# EasyEDA Pro project ProPrj_主车电路板.epro, board PCB3
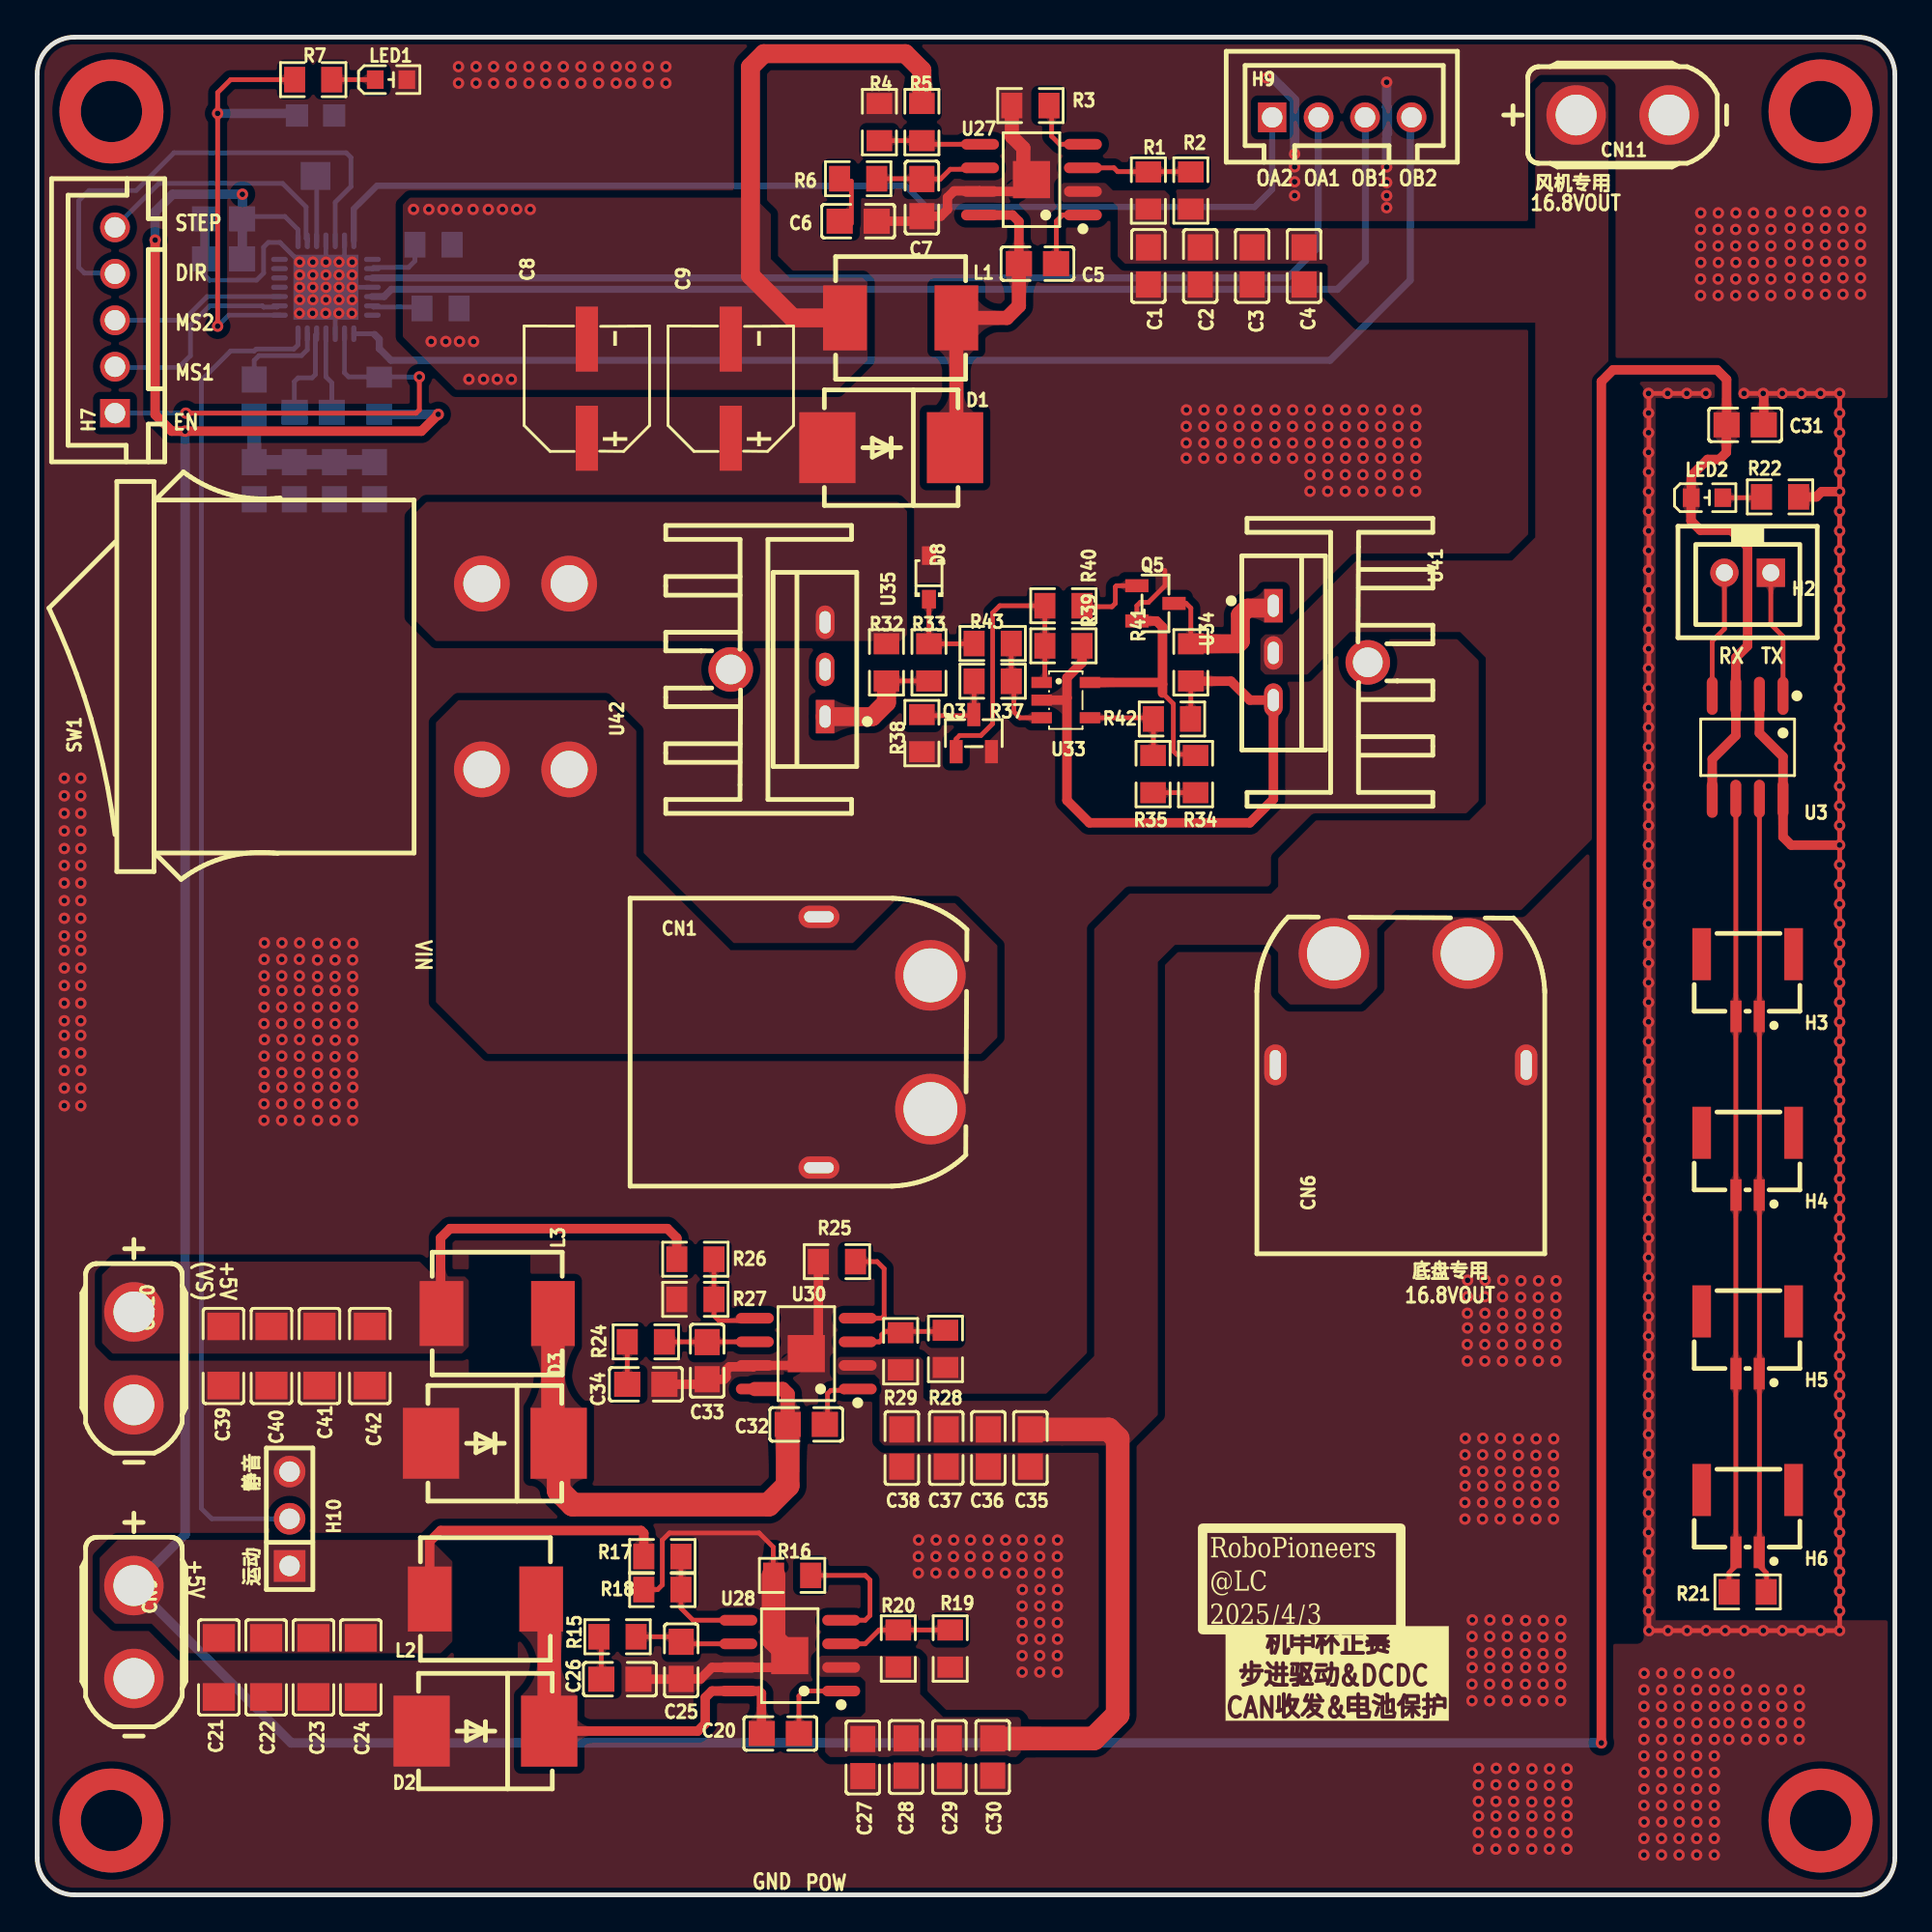
[diagram p5: board, top side]
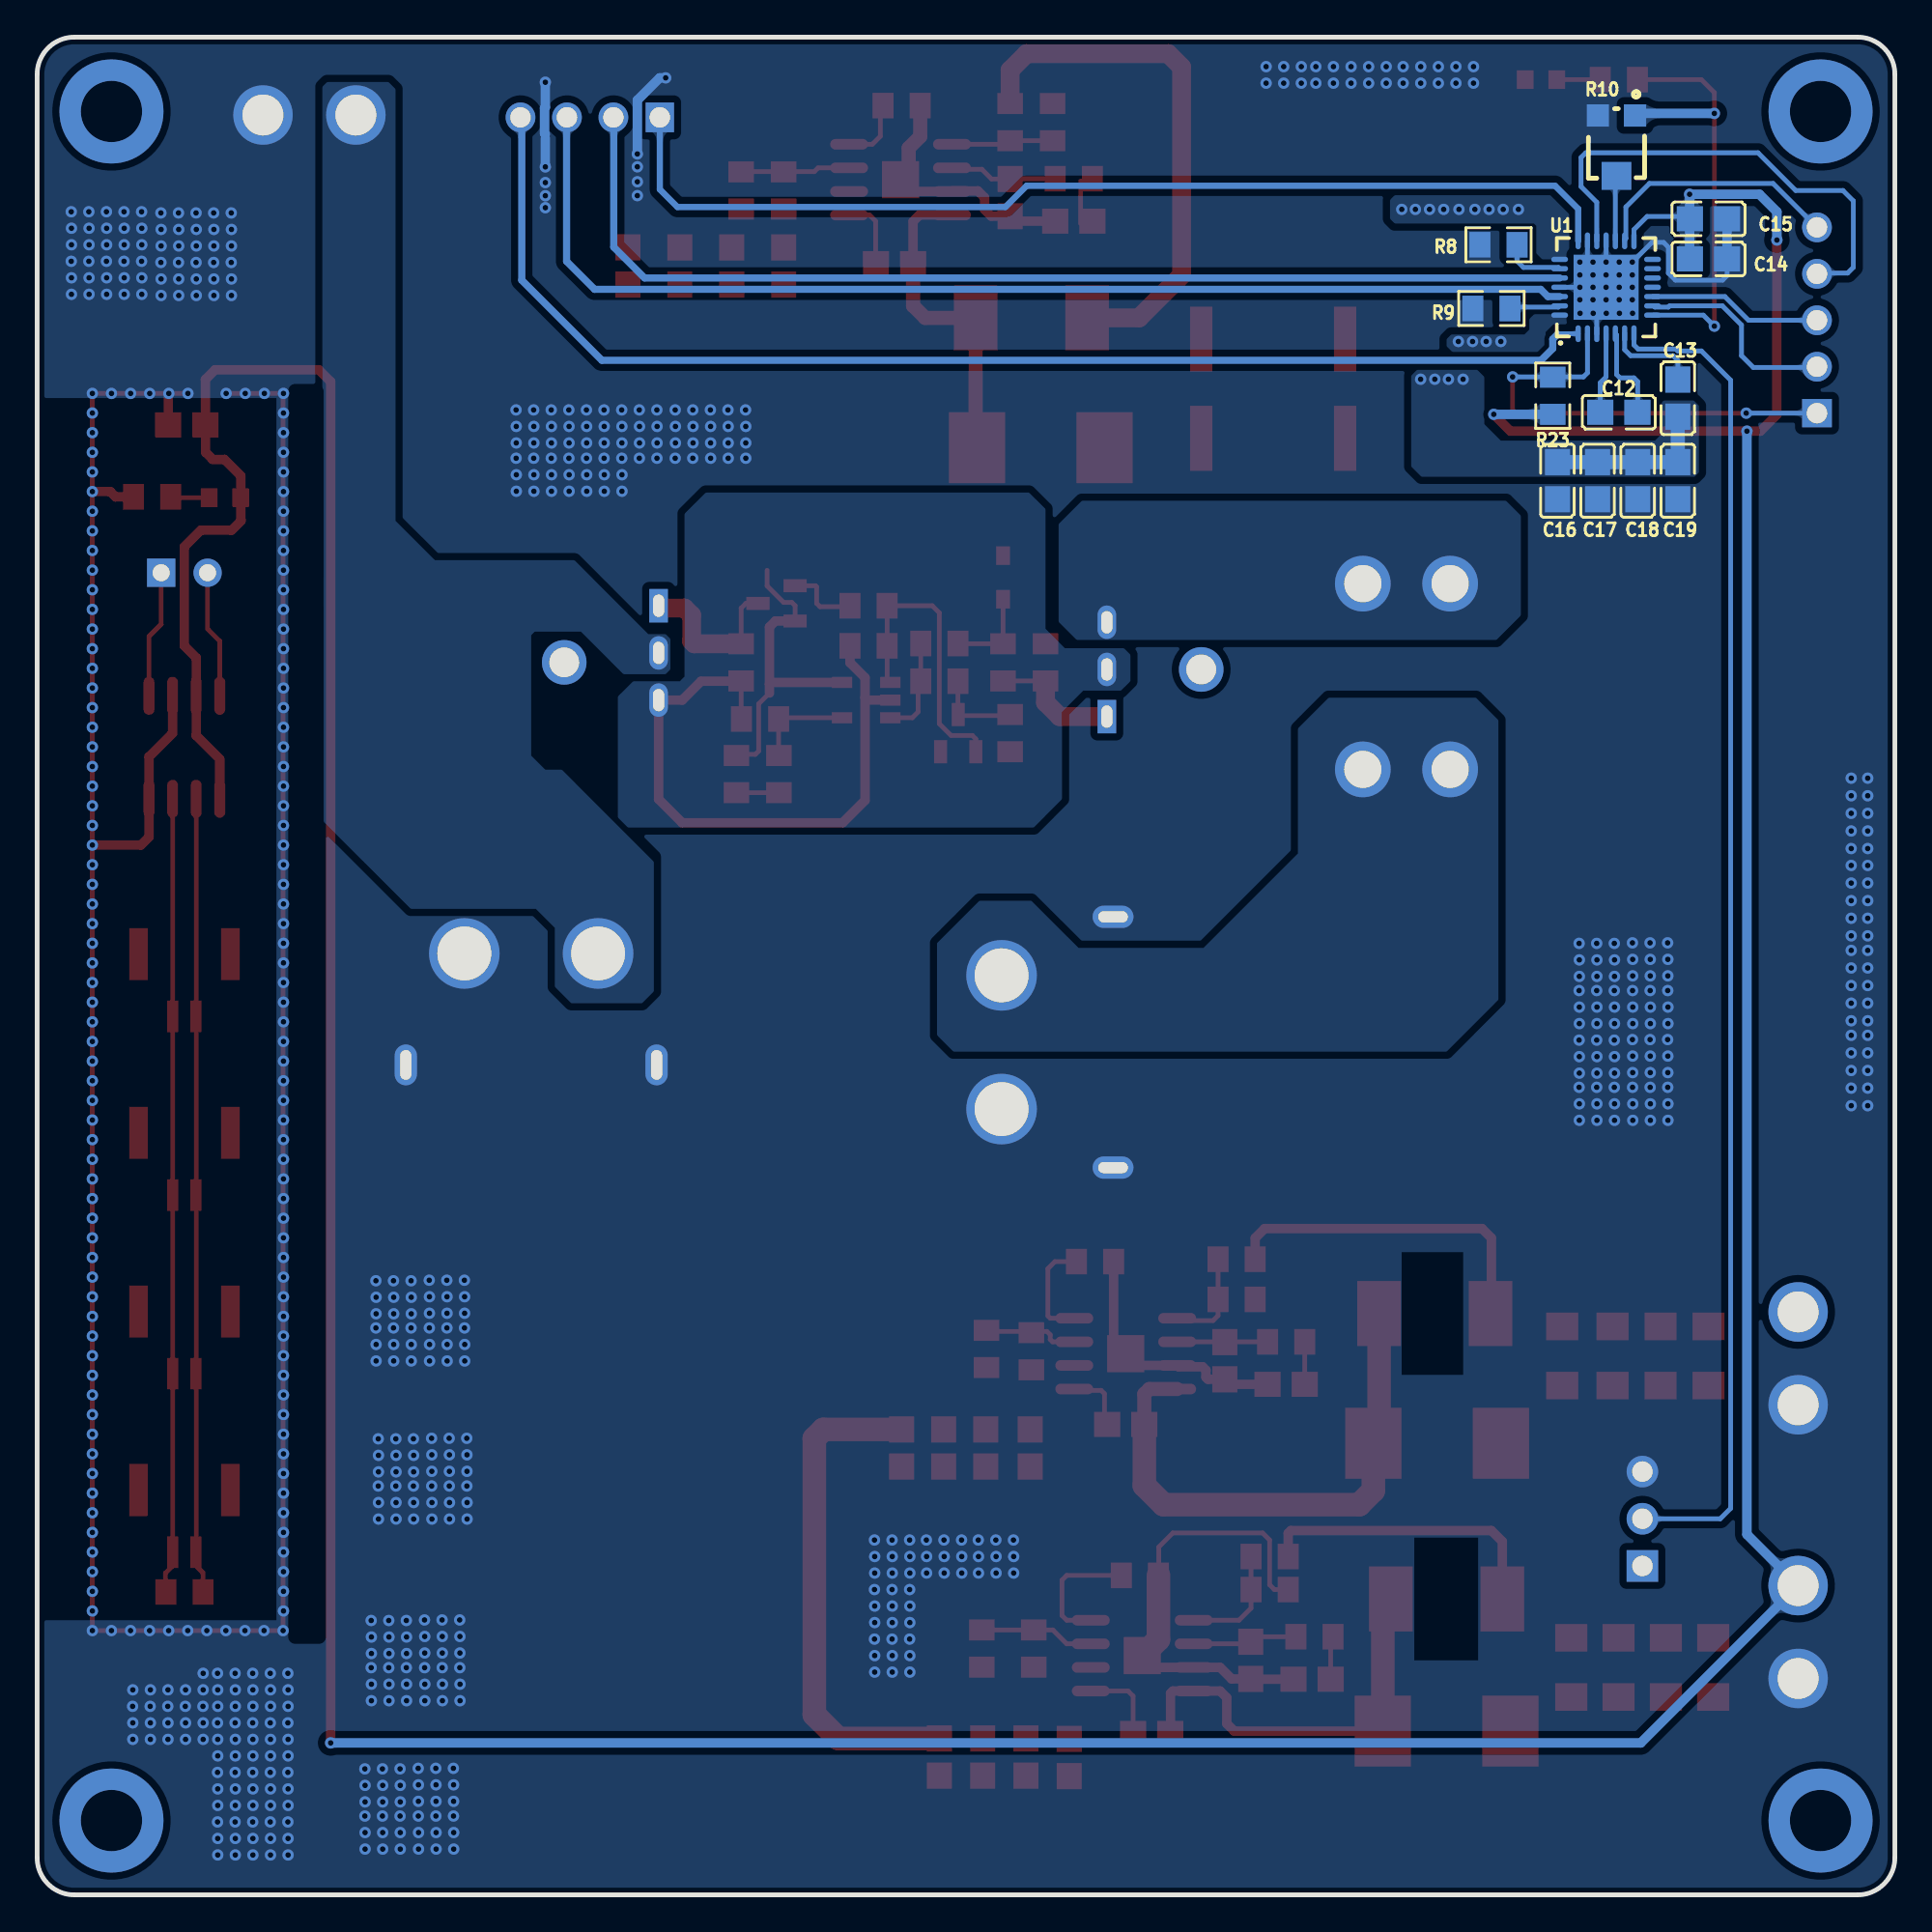
[diagram p6: board, bottom side, seen from below]

Outline 100 x 100 mm; copper layers: Top Layer, Bottom Layer. Coordinates in mm from the lower left corner of the outline.
Outline path: 0,98 0,2 arc(0.59,0.59) 2,0 98,0 arc(99.41,0.59) 100,2 100,98 arc(99.41,99.41) 98,100 2,100 arc(0.59,99.41) 0,98
Stack: Top Layer 0.035mm / Dielectric1 1.51mm FR4 er 4.5 / Bottom Layer 0.035mm

## Design rules (mm)
template: 自定义配置
spacing copperThickness1oz (default): track to track 0.102, other pairs 0.152 to 0.3
spacing copperThickness2oz: track to track 0.203, other pairs 0.152 to 0.3
track width copperThickness1oz (default): min 0.127, default 0.254, max 2.54
track width copperThickness2oz: min 0.203, default 0.254, max 2.54
differential pair differentialPair (default): width min 0.127, default 0.254, max 2.54; gap min 0.152, default 0.152
via viaSize (default): diameter min 0.5, default 0.61, max 10; hole min 0.3, default 0.305, max 6.3
net GND uses copperRegion2
net +12V uses copperRegion1
net +5V uses copperRegion1
net +16.8V uses copperRegion1
net VS uses copperRegion1
net VIN uses copperRegion1
net UBAT uses copperRegion1
net $1N13895 uses copperRegion1

## Placement (name value [footprint] x y rotation side)
C1  10nF  [C0805]  59.82 87.68 90 top
C2  10nF  [C0805]  62.61 87.68 90 top
C3  100nF  [C0805]  65.41 87.68 90 top
C4  100nF  [C0805]  68.2 87.68 90 top
C5  100nF  [C0805]  53.85 87.81 180 top
C6  4.7uF  [C0805]  44.2 90.09 180 top
C7  47pF  [C0805]  47.62 91.36 90 top
C8  47uF  [CAP-SMD_BD6.3-L6.6-W6.6-LS7.2-FD]  29.59 81.08 90 top
C9  47uF  [CAP-SMD_BD6.3-L6.6-W6.6-LS7.2-FD]  37.34 81.08 90 top
C12  22nF  [C0805]  14.86 79.81 180 bottom
C13  100nF  [C0805]  11.68 80.57 90 bottom
C14  10uF  [C0805]  10.03 88.06 0 bottom
C15  100nF  [C0805]  10.03 90.22 0 bottom
C16  100nF  [C0805]  18.16 76.12 270 bottom
C17  100nF  [C0805]  16 76.12 270 bottom
C18  10uF  [C0805]  13.84 76.12 270 bottom
C19  10uF  [C0805]  11.68 76.12 270 bottom
C20  100nF  [C0805]  40 8.69 180 top
C21  47uF  [C1206]  9.78 12.24 90 top
C22  47uF  [C1206]  12.33 12.24 90 top
C23  47uF  [C1206]  14.87 12.24 90 top
C24  47uF  [C1206]  17.42 12.24 90 top
C25  47pF  [C0805]  34.67 12.62 90 top
C26  4.7uF  [C0805]  31.37 11.61 180 top
C27  10nF  [C0805]  44.44 7.39 90 top
C28  10nF  [C0805]  46.77 7.42 90 top
C29  100nF  [C0805]  49.1 7.42 90 top
C30  100nF  [C0805]  51.44 7.42 90 top
C31  100nF  [C0805]  91.94 79.13 0 top
C32  100nF  [C0805]  41.4 25.32 180 top
C33  47pF  [C0805]  36.07 28.75 90 top
C34  4.7uF  [C0805]  32.77 27.48 180 top
C35  10nF  [C0805]  53.47 24.05 90 top
C36  10nF  [C0805]  51.2 24.05 90 top
C37  100nF  [C0805]  48.94 24.05 90 top
C38  100nF  [C0805]  46.55 24.05 90 top
C39  47uF  [C1206]  10.03 29.01 90 top
C40  47uF  [C1206]  12.61 29.01 90 top
C41  47uF  [C1206]  15.2 29.01 90 top
C42  47uF  [C1206]  17.91 29.01 90 top
CN1  XT60PW-M  [CONN-TH_XT60PW-M]  45.09 45.9 0 top
CN6  XT60PW-M  [CONN-TH_XT60PW-M]  73.41 47.68 90 top
CN9  XT30UPB-F30.G.Y  [CONN-TH_XT30UPB-F]  5.21 14.15 270 top
CN10  XT30UPB-F30.G.Y  [CONN-TH_XT30UPB-F]  5.21 28.88 270 top
CN11  XT30UPB-F30.G.Y  [CONN-TH_XT30UPB-F]  85.34 95.81 0 top
D1  B560C-13-F  [SMC_L7.1-W6.2-LS8.1-RD]  45.97 77.9 180 top
D2  B560C-13-F  [SMC_L7.1-W6.2-LS8.1-RD]  24.13 8.81 180 top
D3  B560C-13-F  [SMC_L7.1-W6.2-LS8.1-RD]  24.64 24.31 180 top
D8  BZT52C2V4S  [SOD-323_L1.9-W1.3-LS2.5-RD-1]  48.01 70.92 90 top
H2  BX-XH2.54-2PZZ  [CONN-TH_2P-P2.50_BX-XH2.54-2PZZ]  92.07 71.17 180 top
H3  WAFER-GH1.25-2PLB  [CONN-TH_2P-P1.25_XUNPU_WAFER-GH1.25-2PLB]  92.07 48.96 180 top
H4  WAFER-GH1.25-2PLB  [CONN-TH_2P-P1.25_XUNPU_WAFER-GH1.25-2PLB]  92.07 39.35 180 top
H5  WAFER-GH1.25-2PLB  [CONN-TH_2P-P1.25_XUNPU_WAFER-GH1.25-2PLB]  92.07 29.73 180 top
H6  WAFER-GH1.25-2PLB  [CONN-TH_2P-P1.25_XUNPU_WAFER-GH1.25-2PLB]  92.07 20.12 180 top
H7  ZX-XH2.54-5PZZ  [CONN-TH_5P-P2.50_ZX-XH2.54-5PZZ]  4.19 84.76 90 top
H9  ZX-XH2.54-4PZZ  [CONN-TH_4P-P2.50_4PIN]  70.23 95.68 0 top
H10  PZ254V-11-03P  [HDR-TH_3P-P2.54-V-M]  13.59 20.24 90 top
L1  10uH  [IND-SMD_L7.3-W6.8]  46.48 84.89 180 top
L2  10uH  [IND-SMD_L7.3-W6.8]  24.13 15.93 180 top
L3  10uH  [IND-SMD_L7.3-W6.8]  24.77 31.29 180 top
LED1  YLED0603G  [LED0603-FD]  19.05 97.71 180 top
LED2  YLED0603G  [LED0603-FD]  89.89 75.21 180 top
Q3  SI2302S  [SOT-23-3_L2.9-W1.3-P1.90-LS2.4-BR]  50.42 62.53 270 top
Q5  S9013  [SOT-23-3_L2.9-W1.3-P0.95-LS2.4-BR]  60.2 69.52 180 top
R1  430kΩ  [R0805]  59.82 91.75 270 top
R2  91kΩ  [R0805]  62.1 91.75 90 top
R3  243kΩ  [R0805]  53.47 96.32 0 top
R4  10kΩ  [R0805]  45.34 95.43 270 top
R5  140kΩ  [R0805]  47.62 95.43 90 top
R6  16.9kΩ  [R0805]  44.2 92.38 0 top
R7  243Ω  [R0805]  14.86 97.71 180 top
R8  100mΩ  [R0805]  21.34 88.82 0 bottom
R9  100mΩ  [R0805]  21.72 85.39 0 bottom
R10  10kΩ  [RES-ADJ-SMD_3P-L3.0-W3.8-P1.75-BR]  14.99 94.16 90 bottom
R15  16.9kΩ  [R0805]  31.24 13.89 0 top
R16  243kΩ  [R0805]  40.64 17.2 0 top
R17  53.6kΩ  [R0805]  33.66 18.21 180 top
R18  10.2kΩ  [R0805]  33.66 16.43 0 top
R19  91kΩ  [R0805]  49.15 13.26 90 top
R20  430kΩ  [R0805]  46.35 13.26 270 top
R21  120Ω  [R0805]  92.07 16.31 0 top
R22  243Ω  [R0805]  93.82 75.25 0 top
R23  10kΩ  [R0805]  18.42 80.7 270 bottom
R24  16.9kΩ  [R0805]  32.77 29.77 0 top
R25  243kΩ  [R0805]  43.05 34.09 0 top
R26  53.6kΩ  [R0805]  35.43 34.21 180 top
R27  10.2kΩ  [R0805]  35.43 32.06 0 top
R28  91kΩ  [R0805]  48.9 29.39 90 top
R29  430kΩ  [R0805]  46.48 29.26 270 top
R32  620Ω  [R0805]  45.72 66.34 90 top
R33  2kΩ  [R0805]  48.01 66.34 270 top
R34  50kΩ  [R0805]  62.36 60.33 270 top
R35  10kΩ  [R0805]  60.07 60.33 90 top
R37  10kΩ  [R0805]  51.44 65.33 0 top
R38  340kΩ  [R0805]  47.62 62.53 90 top
R39  10kΩ  [R0805]  55.25 67.23 0 top
R40  10kΩ  [R0805]  55.25 69.39 180 top
R41  10kΩ  [R0805]  62.1 66.34 270 top
R42  10kΩ  [R0805]  61.09 63.3 0 top
R43  50kΩ  [R0805]  51.44 67.36 180 top
SW1  SS21-BBIWP2-R  [SW-TH_SS21-BBIWP2]  26.29 65.58 90 top
U1  TMC2209-LA  [QFN-28_L5.0-W5.0-P0.50-BL-EP]  15.54 86.54 180 bottom
U3  TJA1050T-JSM  [SOIC-8_L4.9-W3.9-P1.27-LS6.0-BL]  92.07 61.77 180 top
U27  TPS54560DDAR  [SOIC-8_L5.0-W4.0-P1.27-LS6.0-BL-EP2.0]  53.52 92.33 90 top
U28  TPS54560DDAR  [SOIC-8_L5.0-W4.0-P1.27-LS6.0-BL-EP2.0]  40.51 12.88 90 top
U30  TPS54560DDAR  [SOIC-8_L5.0-W4.0-P1.27-LS6.0-BL-EP2.0]  41.4 29.13 90 top
U33  TS391ILT  [SOT-23-5_L3.0-W1.7-P0.95-LS2.8-BR]  55.37 64.31 180 top
U34  HSP4119  [TO-220-3_L10.2-W4.5-P2.54-L]  66.55 66.85 270 top
U35  HSP4119  [TO-220-3_L10.2-W4.5-P2.54-L]  42.42 65.96 90 top
U41  15.5*10.5*24  [HEATSINK-TH_L15.5-W10.5-XSD1226-005]  71.63 66.34 270 top
U42  15.5*10.5*24  [HEATSINK-TH_L15.5-W10.5-XSD1226-005]  37.34 65.96 90 top

## Footprints (pads in the part's own frame, mm; a bottom-side part is the same pattern mirrored in y, then rotated)
C0805
  rect 1.41x1.35 smd: 1(-1,0) 2(1,0)
C1206
  rect 1.485x1.728 smd: 1(-1.593,0) 2(1.593,0)
CAP-SMD_BD6.3-L6.6-W6.6-LS7.2-FD
  rect 3.5x1.2 smd: 1(-2.67,0) 2(2.67,0)
CONN-TH_2P-P1.25_XUNPU_WAFER-GH1.25-2PLB
  rect 0.6x1.7 smd: 1(-0.625,1.675) 2(0.625,1.675)
  rect 1x2.8 smd: 3(2.475,-1.675) 4(-2.475,-1.675)
CONN-TH_2P-P2.50_BX-XH2.54-2PZZ
  rect 1.524x1.524 hole 0.914: 1(-1.25,0)
  round 1.524 hole 0.914: 2(1.25,0)
CONN-TH_4P-P2.50_4PIN
  rect 1.524x1.6 hole 1.1: 1(-3.75,0)
  round 1.6 hole 1.1: 2(-1.25,0) 3(1.25,0) 4(3.75,0)
CONN-TH_5P-P2.50_ZX-XH2.54-5PZZ
  rect 1.524x1.6 hole 1.1: 1(-5,0)
  round 1.6 hole 1.1: 2(-2.5,0) 3(0,0) 4(2.5,0) 5(5,0)
CONN-TH_XT30UPB-F
  round 3.2 hole 2.2: 1(-2.5,0) 2(2.5,0)
CONN-TH_XT60PW-M
  round 3.8 hole 2.9: 1(3,-3.6) 2(3,3.6)
  oval 2.2x1.2 hole 1.6x0.6: 3(-3,6.75) 4(-3,-6.75)
HDR-TH_3P-P2.54-V-M
  rect 1.7x1.7 hole 1.1: 1(-2.54,0)
  round 1.7 hole 1.1: 2(0,0) 3(2.54,0)
HEATSINK-TH_L15.5-W10.5-XSD1226-005
  round 2.4 hole 1.6: 1(0,0)
IND-SMD_L7.3-W6.8
  rect 2.35x3.5 smd: 1(-3,0) 2(3,0)
LED0603-FD
  rect 0.9x1 smd: 1(-0.85,0) 2(0.85,0)
QFN-28_L5.0-W5.0-P0.50-BL-EP
  oval 0.28x0.9 smd: 1(-1.502,-2.5) 2(-1.001,-2.5) 3(-0.5,-2.5) 4(0,-2.5) 5(0.5,-2.5) 6(1,-2.5) 7(1.501,-2.5) 15(1.501,2.5) 16(1,2.5) 17(0.5,2.5) 18(0,2.5) 19(-0.5,2.5) 20(-1.001,2.5) 21(-1.502,2.5)
  oval 0.9x0.28 smd: 8(2.5,-1.502) 9(2.5,-1.001) 10(2.5,-0.5) 11(2.5,0) 12(2.5,0.5) 13(2.5,1) 14(2.5,1.501) 22(-2.5,1.501) 23(-2.5,1) 24(-2.5,0.5) 25(-2.5,0) 26(-2.5,-0.5) 27(-2.5,-1.001) 28(-2.5,-1.502)
  rect 3.5x3.5 smd: 29(0,0)
R0805
  rect 1.133x1.377 smd: 1(-1,0) 2(1,0)
RES-ADJ-SMD_3P-L3.0-W3.8-P1.75-BR
  rect 1.2x1.2 smd: 1(1.625,-1) 3(1.625,1)
  rect 1.5x1.6 smd: 2(-1.625,0)
SMC_L7.1-W6.2-LS8.1-RD
  rect 3.03x3.82 smd: 1(-3.435,0) 2(3.435,0)
SOD-323_L1.9-W1.3-LS2.5-RD-1
  rect 1x0.75 smd: 1(-1.173,0) 2(1.173,0)
SOIC-8_L4.9-W3.9-P1.27-LS6.0-BL
  oval 0.588x2.045 smd: 1(-1.905,-2.772) 2(-0.635,-2.772) 3(0.635,-2.772) 4(1.905,-2.772) 5(1.905,2.772) 6(0.635,2.772) 7(-0.635,2.772) 8(-1.905,2.772)
SOIC-8_L5.0-W4.0-P1.27-LS6.0-BL-EP2.0
  oval 0.574x2.038 smd: 1(-1.905,-2.769) 2(-0.635,-2.769) 3(0.635,-2.769) 4(1.905,-2.769) 5(1.905,2.769) 6(0.635,2.769) 7(-0.635,2.769) 8(-1.905,2.769)
  rect 2x2 smd: 9(0,0)
SOT-23-3_L2.9-W1.3-P0.95-LS2.4-BR
  rect 1.25x0.7 smd: 1(1,-0.95) 2(1,0.95) 3(-1,0)
SOT-23-3_L2.9-W1.3-P1.90-LS2.4-BR
  rect 1.25x0.7 smd: 1(1,-0.95) 2(1,0.95) 3(-1,0)
SOT-23-5_L3.0-W1.7-P0.95-LS2.8-BR
  rect 1.1x0.6 smd: 1(1.3,-0.95) 2(1.3,0) 3(1.3,0.95) 4(-1.3,0.95) 5(-1.3,-0.95)
SW-TH_SS21-BBIWP2
  round 3 hole 2: 1(-5,2.35) 2(-5,-2.35) 3(5,2.35) 4(5,-2.35)
TO-220-3_L10.2-W4.5-P2.54-L
  rect 1.8x1 hole 1.2x0.6: 1(-2.54,0)
  oval 1.8x1 hole 1.2x0.6: 2(0,0) 3(2.54,0)

## Nets
As in the schematic.

Pads without a net: H3 3 4; H4 3 4; H5 3 4; H6 3 4; U1 11 12 13 14; U41 1; U42 1

## Via types
v1: diameter 5.6, hole 3.3, Top Layer to Bottom Layer, 4 vias
v2: diameter 0.61, hole 0.305, Top Layer to Bottom Layer, 744 vias

## Routing (per net, layer and track width the routed paths; a pad name or vN(x,y) marks a point on that pad's centre or on a via; arc(x,y) is an arc through that point)
5VOUT: length 24.9
  Top Layer w0.254: v2(9.72,84.44) v2(9.72,95.9) 9.72,97.02 10.41,97.71 R7.2
  Bottom Layer w0.254: U1.8 10.31,85.04 v2(9.72,84.44)
  Bottom Layer w0.508: R10.1 13.87,95.9 v2(9.72,95.9)
+5V: length 311.8
  Top Layer w0.508: 90.93,79.12 90.93,77.65 90.55,77.27 89.92,77.27 89.04,76.39 LED2.2 89.03,75.2 89.03,73.97 89.53,73.46 91.19,73.46 92.07,72.57 92.07,67.23 91.44,66.6 U3.3 91.44,62.41 90.17,61.14 U3.5 ; C31.1 90.94,81.57 90.42,82.09 84.84,82.09 84.2,81.46 v2(84.2,8.18) ; R17.2 32.66,19.47 32.51,19.61 21.72,19.61 21.13,19.02 L2.2 ; v2(21.59,79.7) 20.69,78.79 v2(7.96,78.79) 7.24,78.79 6.35,79.68 v2(6.35,89.08)
  Bottom Layer w0.254: 11.1,90.01 11.43,90.35 13.33,90.35 14.04,89.64 U1.15
  Bottom Layer w0.508: v2(84.2,8.18) 13.68,8.18 CN9.1 7.96,19.4 v2(7.96,78.79) ; v2(6.35,89.08) 6.35,90.6 7.29,91.54 v2(11.05,91.54) 11.05,88.08 C14.2 ; v2(21.59,79.7) R23.2
+12V: length 37.9
  Top Layer w1.016: L1.2 40.68,84.89 38.4,87.17 38.4,98.39 39.12,99.11 46.74,99.11 47.62,98.22 R5.2
  Bottom Layer w0.762: C13.1 C19.1 C18.1 C17.1 C16.1
  vias: v2(20.26,90.73) v2(21.08,90.73) v2(21.21,83.62) v2(21.84,90.73) v2(22,83.62) v2(22.61,90.73) v2(22.73,83.62) v2(23.24,81.58) v2(23.47,90.73) v2(23.5,83.62) v2(24.03,81.58) v2(24.29,90.73) v2(24.77,81.58) v2(25.05,90.73) v2(25.53,81.58) v2(25.81,90.73) v2(26.54,90.73)
+16.8V: length 27
  Top Layer w1.27: C35.2 57.67,25.05 58.17,24.56 58.17,9.7 56.88,8.42 C30.2
GND: length 258.8
  Top Layer w0.254: 60.71,71.3 60.71,70.46 59.82,69.57 59.38,69.57 59.2,69.39 Q5.2 ; R16.1 39.62,17.21 39.62,18.72 38.86,19.48 34.04,19.48 33.66,19.1 33.66,16.69 33.4,16.43 R18.1 ; 60.58,64.69 61.16,64.11 61.16,61.57 61.34,61.39 62.3,61.39 R34.1 ; v2(91.88,80.82) v2(92.91,80.82) v2(93.94,80.82) v2(94.97,80.82) v2(96,80.82) v2(97.03,80.82) v2(97.03,79.77) v2(97.03,78.71) v2(97.03,77.65) v2(97.03,76.59) v2(97.03,75.54) v2(97.03,74.48) v2(97.03,73.42) v2(97.03,72.37) v2(97.03,71.31) v2(97.03,70.25) v2(97.03,69.19) v2(97.03,68.14) v2(97.03,67.08) v2(97.03,66.02) v2(97.03,64.97) v2(97.03,63.91) v2(97.03,62.85) v2(97.03,61.8) v2(97.03,60.74) v2(97.03,59.68) v2(97.03,58.62) v2(97.03,57.57) v2(97.03,56.51) v2(97.03,55.45) v2(97.03,54.39) v2(97.03,53.34) v2(97.03,52.28) v2(97.03,51.22) v2(97.03,50.17) v2(97.03,49.11) v2(97.03,48.05) v2(97.03,47) v2(97.03,45.94) v2(97.03,44.88) v2(97.03,43.82) v2(97.03,42.77) v2(97.03,41.71) v2(97.03,40.65) v2(97.03,39.59) v2(97.03,38.54) v2(97.03,37.48) v2(97.03,36.42) v2(97.03,35.37) v2(97.03,34.31) v2(97.03,33.25) v2(97.03,32.2) v2(97.03,31.14) v2(97.03,30.08) v2(97.03,29.02) v2(97.03,27.97) v2(97.03,26.91) v2(97.03,25.85) v2(97.03,24.8) v2(97.03,23.74) v2(97.03,22.68) v2(97.03,21.62) v2(97.03,20.57) v2(97.03,19.51) v2(97.03,18.45) v2(97.03,17.4) v2(97.03,16.34) v2(97.03,15.28) v2(97.03,14.22) v2(96,14.22) v2(94.97,14.22) v2(93.95,14.22) v2(92.92,14.22) v2(91.89,14.22) v2(90.87,14.22) v2(89.84,14.22) v2(88.81,14.22) v2(87.79,14.22) v2(86.76,14.22) 86.76,80.8 v2(86.74,80.82) v2(87.77,80.82) v2(88.8,80.82) v2(89.83,80.82)
  Top Layer w0.508: v2(97.03,56.51) 94.42,56.51 93.98,56.95 U3.8 93.98,61.27 92.71,62.53 U3.2 ; C34.1 35.8,27.48 C33.1 36.97,27.75 37.08,27.86 37.08,28.25 37.26,28.42 38.56,28.42 U30.7 40.77,28.5 40.9,28.63 ; U33.5 60.49,65.26 60.58,65.17 ; 60.58,65.17 60.58,64.69 ; 60.58,65.17 60.58,68.25 60.26,68.57 Q5.2 ; 40.01,12.38 39.88,12.24 U28.7 36.32,12.24 35.7,11.62 C25.1 34.66,11.61 C26.1 ; R25.1 42.05,29.78 41.9,29.63 ; 53.02,91.83 52.89,91.69 50.75,91.69 50.73,91.72 49.36,91.72 49,91.36 49,90.72 48.64,90.36 C7.1 47.35,90.09 C6.1 ; R22.2 95.78,75.25 96.06,75.54 v2(97.03,75.54) ; v2(92.91,80.82) 92.94,80.79 C31.2
  Top Layer w0.762: R3.1 52.47,94.65 53.09,94.03 53.09,92.89 53.02,92.83
  Top Layer w1.27: 40.01,13.38 39.64,13.75 R16.1
  Bottom Layer w0.254: v2(15.54,86.54) 16.55,87.54 U1.20 ; U1.25 v2(16.96,86.54) ; U1.3 16.05,84.94 v2(16.24,85.14) ; v2(14.13,87.89) 13.07,88.95 12.45,88.95 12.19,88.7 12.19,87.3 11.81,86.92 9.27,86.92 9.03,87.16 C14.1 ; U1.18 v2(15.54,87.89)
  Bottom Layer w0.508: C15.1 C14.1 ; v2(72.64,97.57) 72.64,96.22 72.69,96.18 72.69,94.82 72.64,94.78 ; v2(72.64,93.02) 72.64,94.54 ; v2(66.17,97.81) 66.49,97.81 67.69,96.61 v2(67.69,93.71)
  vias: v2(1.46,60.11) v2(1.46,59.16) v2(1.46,58.22) v2(1.46,57.27) v2(1.46,56.32) v2(1.46,55.41) v2(1.46,54.47) v2(1.46,53.52) v2(1.46,52.57) v2(1.46,51.62) v2(1.46,50.84) v2(1.46,49.89) v2(1.46,48.95) v2(1.46,48) v2(1.46,47.05) v2(1.46,46.27) v2(1.46,45.32) v2(1.46,44.38) v2(1.46,43.43) v2(1.46,42.48) v2(2.35,60.11) v2(2.35,59.16) v2(2.35,58.22) v2(2.35,57.27) v2(2.35,56.32) v2(2.35,55.41) v2(2.35,54.47) v2(2.35,53.52) v2(2.35,52.57) v2(2.35,51.62) v2(2.35,50.84) v2(2.35,49.89) v2(2.35,48.95) v2(2.35,48) v2(2.35,47.05) v2(2.35,46.27) v2(2.35,45.32) v2(2.35,44.38) v2(2.35,43.43) v2(2.35,42.48) v2(12.23,51.25) v2(12.22,50.36) v2(12.22,49.47) v2(12.23,48.68) v2(12.21,47.79) v2(12.21,46.9) v2(12.23,46.04) v2(12.22,45.15) v2(12.22,44.26) v2(12.23,43.47) v2(12.21,42.58) v2(12.21,41.69) v2(13.18,51.25) v2(13.17,50.36) v2(13.17,49.47) v2(13.17,48.68) v2(13.16,47.79) v2(13.16,46.9) v2(13.18,46.04) v2(13.17,45.15) v2(13.17,44.26) v2(13.17,43.47) v2(13.16,42.58) v2(13.16,41.69) v2(14.13,87.2) v2(14.13,86.54) v2(14.13,85.86) v2(14.12,85.14) v2(14.12,51.25) v2(14.11,50.36) v2(14.11,49.47) v2(14.12,48.68) v2(14.11,47.79) v2(14.11,46.9) v2(14.12,46.04) v2(14.11,45.15) v2(14.11,44.26) v2(14.12,43.47) v2(14.11,42.58) v2(14.11,41.69) v2(14.84,87.89) v2(14.84,87.2) v2(14.84,86.54) v2(14.84,85.86) v2(14.83,85.14) v2(15.1,51.22) v2(15.09,50.33) v2(15.09,49.44) v2(15.1,48.68) v2(15.09,47.79) v2(15.09,46.9) v2(15.1,46.01) v2(15.09,45.12) v2(15.09,44.23) v2(15.1,43.47) v2(15.09,42.58) v2(15.09,41.69) v2(15.55,87.2) v2(15.55,85.86) v2(15.53,85.14) v2(16.05,51.22) v2(16.04,50.33) v2(16.04,49.44) v2(16.05,48.68) v2(16.04,47.79) v2(16.04,46.9) v2(16.05,46.01) v2(16.04,45.12) v2(16.04,44.23) v2(16.05,43.47) v2(16.04,42.58) v2(16.04,41.69) v2(16.25,87.89) v2(16.25,87.2) v2(16.25,86.54) v2(16.25,85.86) v2(16.94,85.14) v2(16.96,87.89) v2(16.96,87.2) v2(16.96,85.86) v2(17,51.22) v2(16.98,50.33) v2(16.98,49.44) v2(17,48.68) v2(16.98,47.79) v2(16.98,46.9) v2(17,46.01) v2(16.98,45.12) v2(16.98,44.23) v2(17,43.47) v2(16.98,42.58) v2(16.98,41.69) v2(22.68,98.41) v2(22.68,97.52) v2(23.63,98.41) v2(23.63,97.52) v2(24.57,98.41) v2(24.57,97.52) v2(25.52,98.41) v2(25.52,97.52) v2(26.47,98.41) v2(26.47,97.52) v2(27.38,98.41) v2(27.38,97.52) v2(28.33,98.41) v2(28.33,97.52) v2(29.27,98.41) v2(29.27,97.52) v2(30.22,98.41) v2(30.22,97.52) v2(31.17,98.41) v2(31.17,97.52) v2(31.95,98.41) v2(31.95,97.52) v2(32.9,98.41) v2(32.9,97.52) v2(33.84,98.41) v2(33.84,97.52) v2(47.45,19.1) v2(47.43,18.21) v2(47.43,17.32) v2(48.39,19.1) v2(48.38,18.21) v2(48.38,17.32) v2(49.34,19.1) v2(49.33,18.21) v2(49.33,17.32) v2(50.24,19.1) v2(50.23,18.21) v2(50.23,17.32) v2(51.19,19.1) v2(51.18,18.21) v2(51.18,17.32) v2(52.13,19.1) v2(52.12,18.21) v2(52.12,17.32) v2(53.03,19.1) v2(53.02,18.21) v2(53.02,17.32) v2(53.03,16.43) v2(53.02,15.54) v2(53.02,14.66) v2(53.03,13.77) v2(53.02,12.88) v2(53.02,11.99) v2(53.98,19.1) v2(53.97,18.21) v2(53.97,17.32) v2(53.98,16.43) v2(53.97,15.54) v2(53.97,14.66) v2(53.98,13.77) v2(53.97,12.88) v2(53.97,11.99) v2(54.93,19.1) v2(54.92,18.21) v2(54.92,17.32) v2(54.93,16.43) v2(54.92,15.54) v2(54.92,14.66) v2(54.93,13.77) v2(54.92,12.88) v2(54.92,11.99) v2(61.87,79.93) v2(61.85,79.05) v2(61.85,78.16) v2(61.85,77.33) v2(62.81,79.93) v2(62.8,79.05) v2(62.8,78.16) v2(62.8,77.33) v2(63.75,79.05) v2(63.75,78.16) v2(63.75,77.33) v2(63.76,79.93) v2(64.71,79.93) v2(64.69,79.05) v2(64.69,78.16) v2(64.71,77.33) v2(65.64,79.05) v2(65.64,78.16) v2(65.65,79.93) v2(65.65,77.33) v2(66.64,79.93) v2(66.63,79.05) v2(66.63,78.16) v2(66.64,77.33) v2(67.59,79.93) v2(67.58,79.05) v2(67.58,78.16) v2(67.58,77.33) v2(67.69,93.02) v2(67.69,92.22) v2(67.69,91.47) v2(68.53,79.93) v2(68.52,79.05) v2(68.52,78.16) v2(68.53,77.33) v2(68.52,76.44) v2(68.52,75.56) v2(69.49,79.93) v2(69.47,79.05) v2(69.47,78.16) v2(69.48,77.33) v2(69.47,76.44) v2(69.47,75.56) v2(70.43,79.93) v2(70.42,79.05) v2(70.42,78.16) v2(70.43,77.33) v2(70.42,76.44) v2(70.42,75.56) v2(71.38,79.93) v2(71.37,79.05) v2(71.37,78.16) v2(71.38,77.33) v2(71.36,76.44) v2(71.36,75.56) v2(72.33,79.93) v2(72.32,79.05) v2(72.32,78.16) v2(72.32,77.33) v2(72.31,76.44) v2(72.31,75.56) v2(72.64,92.17) v2(72.64,91.46) v2(72.64,90.82) v2(73.28,79.93) v2(73.26,79.05) v2(73.26,78.16) v2(73.27,77.33) v2(73.26,76.44) v2(73.26,75.56) v2(74.22,79.93) v2(74.21,79.05) v2(74.21,78.16) v2(74.22,77.33) v2(74.21,76.44) v2(74.21,75.56) v2(76.88,24.58) v2(76.86,23.69) v2(76.86,22.8) v2(76.87,22.01) v2(76.86,21.12) v2(76.86,20.23) v2(77,33.09) v2(76.99,32.2) v2(76.99,31.31) v2(77,30.52) v2(76.98,29.63) v2(76.98,28.74) v2(77.24,13.91) v2(77.24,13.02) v2(77.25,12.23) v2(77.24,11.34) v2(77.24,10.45) v2(77.26,14.8) v2(77.6,6.81) v2(77.58,5.92) v2(77.58,5.03) v2(77.59,4.24) v2(77.58,3.35) v2(77.58,2.46) v2(77.82,24.58) v2(77.81,23.69) v2(77.81,22.8) v2(77.82,22.01) v2(77.8,21.12) v2(77.8,20.23) v2(77.95,33.09) v2(77.94,32.2) v2(77.94,31.31) v2(77.94,30.52) v2(77.93,29.63) v2(77.93,28.74) v2(78.2,14.8) v2(78.19,13.91) v2(78.19,13.02) v2(78.2,12.23) v2(78.18,11.34) v2(78.18,10.45) v2(78.54,6.81) v2(78.53,5.92) v2(78.53,5.03) v2(78.54,4.24) v2(78.52,3.35) v2(78.52,2.46) v2(78.77,24.58) v2(78.76,23.69) v2(78.76,22.8) v2(78.76,22.01) v2(78.75,21.12) v2(78.75,20.23) v2(78.9,33.09) v2(78.88,32.2) v2(78.88,31.31) v2(78.89,30.52) v2(78.88,29.63) v2(78.88,28.74) v2(79.15,14.8) v2(79.14,13.91) v2(79.14,13.02) v2(79.14,12.23) v2(79.13,11.34) v2(79.13,10.45) v2(79.49,6.81) v2(79.48,5.92) v2(79.48,5.03) v2(79.48,4.24) v2(79.47,3.35) v2(79.47,2.46) v2(79.75,24.55) v2(79.73,23.66) v2(79.73,22.77) v2(79.75,22.01) v2(79.73,21.12) v2(79.73,20.23) v2(79.87,33.06) v2(79.86,32.17) v2(79.86,31.28) v2(79.87,30.52) v2(79.86,29.63) v2(79.86,28.74) v2(80.13,14.77) v2(80.12,13.88) v2(80.12,12.99) v2(80.13,12.23) v2(80.12,11.34) v2(80.12,10.45) v2(80.47,6.78) v2(80.45,5.89) v2(80.45,5) v2(80.47,4.24) v2(80.45,3.35) v2(80.45,2.46) v2(80.69,24.55) v2(80.68,23.66) v2(80.68,22.77) v2(80.69,22.01) v2(80.68,21.12) v2(80.68,20.23) v2(80.82,33.06) v2(80.81,32.17) v2(80.81,31.28) v2(80.82,30.52) v2(80.81,29.63) v2(80.81,28.74) v2(81.07,14.77) v2(81.06,13.88) v2(81.06,12.99) v2(81.07,12.23) v2(81.06,11.34) v2(81.06,10.45) v2(81.41,6.78) v2(81.4,5.89) v2(81.4,5) v2(81.41,4.24) v2(81.4,3.35) v2(81.4,2.46) v2(81.64,24.55) v2(81.63,23.66) v2(81.63,22.77) v2(81.64,22.01) v2(81.63,21.12) v2(81.63,20.23) v2(81.77,33.06) v2(81.75,32.17) v2(81.75,31.28) v2(81.77,30.52) v2(81.75,29.63) v2(81.75,28.74) v2(82.02,14.77) v2(82.01,13.88) v2(82.01,12.99) v2(82.02,12.23) v2(82.01,11.34) v2(82.01,10.45) v2(82.35,5.89) v2(82.35,5) v2(82.35,3.35) v2(82.35,2.46) v2(82.36,6.78) v2(82.36,4.24) v2(86.5,11.93) v2(86.49,11.04) v2(86.49,10.15) v2(86.5,9.26) v2(86.49,8.37) v2(86.49,7.48) v2(86.5,6.59) v2(86.49,5.7) v2(86.49,4.81) v2(86.5,3.92) v2(86.49,3.04) v2(86.49,2.15) v2(86.74,79.77) v2(86.74,78.71) v2(86.74,77.65) v2(86.74,76.59) v2(86.74,75.54) v2(86.74,74.48) v2(86.74,73.42) v2(86.74,72.37) v2(86.74,71.31) v2(86.74,70.25) v2(86.74,69.19) v2(86.74,68.14) v2(86.74,67.08) v2(86.74,66.02) v2(86.74,64.97) v2(86.74,63.91) v2(86.74,62.85) v2(86.74,61.8) v2(86.74,60.74) v2(86.74,59.68) v2(86.74,58.62) v2(86.74,57.57) v2(86.74,56.51) v2(86.74,55.45) v2(86.74,54.39) v2(86.74,53.34) v2(86.74,52.28) v2(86.74,51.22) v2(86.74,50.17) v2(86.74,49.11) v2(86.74,48.05) v2(86.74,47) v2(86.74,45.94) v2(86.74,44.88) v2(86.74,43.82) v2(86.74,42.77) v2(86.74,41.71) v2(86.74,40.65) v2(86.74,39.59) v2(86.74,38.54) v2(86.74,37.48) v2(86.74,36.42) v2(86.74,35.37) v2(86.74,34.31) v2(86.74,33.25) v2(86.74,32.2) v2(86.74,31.14) v2(86.74,30.08) v2(86.74,29.02) v2(86.74,27.97) v2(86.74,26.91) v2(86.74,25.85) v2(86.74,24.8) v2(86.74,23.74) v2(86.74,22.68) v2(86.74,21.62) v2(86.74,20.57) v2(86.74,19.51) v2(86.74,18.45) v2(86.74,17.4) v2(86.74,16.34) v2(86.74,15.28) v2(87.44,11.04) v2(87.44,10.15) v2(87.44,8.37) v2(87.44,7.48) v2(87.44,5.7) v2(87.44,4.81) v2(87.44,3.04) v2(87.44,2.15) v2(87.45,11.93) v2(87.45,9.26) v2(87.45,6.59) v2(87.45,3.92) v2(88.4,11.93) v2(88.39,11.04) v2(88.39,10.15) v2(88.4,9.26) v2(88.39,8.37) v2(88.39,7.48) v2(88.4,6.59) v2(88.39,5.7) v2(88.39,4.81) v2(88.4,3.92) v2(88.39,3.04) v2(88.39,2.15) v2(89.34,11.93) v2(89.33,11.04) v2(89.33,10.15) v2(89.34,9.26) v2(89.33,8.37) v2(89.33,7.48) v2(89.34,6.59) v2(89.33,5.7) v2(89.33,4.81) v2(89.34,3.92) v2(89.33,3.04) v2(89.33,2.15) v2(89.54,89.65) v2(89.54,88.76) v2(89.54,86.98) v2(89.54,86.09) v2(89.55,90.54) v2(89.55,87.87) v2(90.29,11.93) v2(90.28,11.04) v2(90.28,10.15) v2(90.29,9.26) v2(90.28,8.37) v2(90.28,7.48) v2(90.29,6.59) v2(90.28,5.7) v2(90.28,4.81) v2(90.29,3.92) v2(90.28,3.04) v2(90.28,2.15) v2(90.5,90.54) v2(90.49,89.65) v2(90.49,88.76) v2(90.5,87.87) v2(90.49,86.98) v2(90.49,86.09) v2(91.06,11.93) v2(91.06,11.04) v2(91.08,10.15) v2(91.06,9.26) v2(91.06,8.37) v2(91.45,90.54) v2(91.43,89.65) v2(91.43,88.76) v2(91.45,87.87) v2(91.43,86.98) v2(91.43,86.09) v2(92.01,11.04) v2(92.02,10.15) v2(92.01,9.26) v2(92.01,8.37) v2(92.39,90.54) v2(92.38,89.65) v2(92.38,88.76) v2(92.39,87.87) v2(92.38,86.98) v2(92.38,86.09) v2(92.96,11.04) v2(92.97,10.15) v2(92.96,9.26) v2(92.96,8.37) v2(93.34,90.54) v2(93.33,89.65) v2(93.33,88.76) v2(93.34,87.87) v2(93.33,86.98) v2(93.33,86.09) v2(93.9,11.04) v2(93.92,10.15) v2(93.9,9.26) v2(93.9,8.37) v2(94.38,90.6) v2(94.37,89.71) v2(94.37,88.82) v2(94.38,87.94) v2(94.37,87.05) v2(94.37,86.16) v2(94.85,11.04) v2(94.86,10.15) v2(94.85,9.26) v2(94.85,8.37) v2(95.33,90.6) v2(95.31,89.71) v2(95.31,88.82) v2(95.33,87.94) v2(95.31,87.05) v2(95.31,86.16) v2(96.27,90.6) v2(96.26,89.71) v2(96.26,88.82) v2(96.27,87.94) v2(96.26,87.05) v2(96.26,86.16) v2(97.22,90.6) v2(97.21,89.71) v2(97.21,88.82) v2(97.22,87.94) v2(97.21,87.05) v2(97.21,86.16) v2(98.16,90.6) v2(98.15,89.71) v2(98.15,88.82) v2(98.16,87.94) v2(98.15,87.05) v2(98.15,86.16)
(no net):
  vias: v1(4,96) v1(4,4) v1(96,96) v1(96,4)
CANH: length 42.9
  Top Layer w0.254: R21.2 93.09,16.32 93.09,17.32 92.71,17.7 U3.7
CANL: length 42.8
  Top Layer w0.254: U3.6 91.44,17.7 91.07,17.34 R21.1
CANRX: length 6.9
  Top Layer w0.254: U3.4 90.17,67.49 90.82,68.14 H2.2
CANTX: length 6.9
  Top Layer w0.254: H2.1 93.32,68.4 93.98,67.74 U3.1
DIR: length 26.4
  Bottom Layer w0.254: U1.19 16.05,91.11 16.89,91.96 16.89,93.52 16.64,93.78 7.37,93.78 5.33,91.75 2.79,91.75 2.23,91.18 2.23,87.61 2.54,87.3 4.15,87.3 H7.4
EN: length 24.5
  Top Layer w0.254: v2(20.57,81.71) 20.57,79.93 20.4,79.76 v2(8,79.76)
  Bottom Layer w0.254: H7.1 v2(8,79.76) ; U1.2 16.55,81.93 16.76,81.71 18.4,81.71 R23.1 18.43,81.71 v2(20.57,81.71)
MS1: length 11.3
  Bottom Layer w0.254: U1.9 12.98,85.54 12.91,85.47 12.19,85.47 12.12,85.54 9.28,85.54 8.25,84.51 8.25,82.86 7.62,82.22 4.23,82.22 H7.2
MS2: length 9.4
  Bottom Layer w0.254: U1.10 9.15,86.04 7.87,84.76 H7.3
OA1: length 58.6
  Bottom Layer w0.381: U1.24 67.3,87.04 68.96,88.7 68.96,95.66 H9.2
OA2: length 56.4
  Bottom Layer w0.33: H9.1 66.48,91.81 65.53,90.86 47.88,90.86 46.74,92 18.29,92 17.05,90.76 U1.21
OB1: length 62
  Bottom Layer w0.381: H9.3 71.5,95.66 71.5,87.94 69.99,86.43 19.06,86.43 18.67,86.04 U1.26
OB2: length 68.3
  Bottom Layer w0.254: U1.1 18.12,84.04
  Bottom Layer w0.381: 18.16,84 18.42,83.74 18.42,83.24 19.05,82.61 69.6,82.61 73.91,86.92 73.91,95.61 H9.4
SPREAD: length 72.3
  Bottom Layer w0.254: H10.2 9.4,20.24 8.84,20.8 8.84,81.53 10.41,83.11 11.69,83.11 11.79,83.21 13.82,83.21 14.04,83.44 U1.7
STEP: length 13.6
  Bottom Layer w0.254: H7.5 6.56,92.13 13.21,92.13 14.48,90.86 14.48,89.17 14.54,89.1 U1.16
VS: length 18.4
  Top Layer w0.508: R26.2 34.43,35.36 33.93,35.86 22.22,35.86 21.72,35.36 21.72,31.34 L3.2
$1N2057: length 3.6
  Top Layer w0.254: R3.2 54.61,96.17 54.61,94.67 55.04,94.23 U27.4
$1N2062: length 3.9
  Top Layer w0.254: C5.1 54.86,87.82 54.86,90.09 55.19,90.42 U27.1
$1N2064: length 5.9
  Top Layer w0.254: U27.3 57.96,92.96 58.17,92.76 62.09,92.76 R2.2
$1N2070: length 5.8
  Top Layer w0.254: R6.2 47.61,92.38 C7.2 48.62,92.36 49.15,92.89 50.68,92.89 50.75,92.96
$1N2071: length 5.5
  Top Layer w0.254: 50.75,94.23 47.82,94.23 R5.1 R4.2
$1N2072: length 2.3
  Top Layer w0.254: 43.83,92.25 43.83,89.97
$1N2073: length 17.7
  Top Layer w0.508: 50.75,90.42 52.5,90.42 52.85,90.08 C5.2
  Top Layer w0.762: C5.2 52.85,85.54 52.2,84.89 L1.1 49.48,78.21 49.92,77.78
$1N3950: length 5.2
  Bottom Layer w0.254: U1.5 14.98,83.97 14.98,81.84 14.8,81.66 14.04,81.66 13.84,81.46 13.84,79.82 C12.2
$1N3978: length 4.4
  Bottom Layer w0.254: C12.1 15.86,81.4 15.54,81.71 U1.4
$1N4053: length 5
  Bottom Layer w0.254: C13.2 11.68,82.6 11.94,82.86 14.22,82.86 14.54,83.17 U1.6
$1N4165: length 2.3
  Top Layer w0.254: R7.1 LED1.2
$1N4399: length 3.5
  Bottom Layer w0.254: R10.2 15.04,92.47 U1.17
$1N4638: length 3.3
  Bottom Layer w0.254: R8.1 20.34,87.95 19.99,87.6 18.11,87.6 18.04,87.54
$1N4642: length 2.7
  Bottom Layer w0.254: U1.27 18.11,85.47 20.64,85.47 R9.1
$1N6180: length 6.9
  Top Layer w0.254: U28.4 44.58,14.78 44.83,15.04 44.83,16.94 44.58,17.2 R16.2
$1N6185: length 4.4
  Top Layer w0.254: C20.1 41,10.7 41.28,10.97 U28.1
$1N6187: length 6.2
  Top Layer w0.254: R19.2 R20.1 45.32,14.26 44.58,13.51 U28.3
$1N6193: length 5.7
  Top Layer w0.254: U28.6 34.78,13.51 C25.2 34.4,13.89 R15.2
$1N6194: length 6.1
  Top Layer w0.254: U28.5 35.31,14.78 34.66,15.43 R18.2 R17.1
$1N6195: length 2.3
  Top Layer w0.254: C26.2 30.37,13.77 R15.1
$1N6196: length 22.6
  Top Layer w0.508: C20.2 38.99,8.7 38.99,10.85 38.86,10.97 U28.8 36.32,10.97 35.96,10.61 35.96,9.22 35.56,8.81 D2.1
  Top Layer w1.27: L2.1 27.56,15.49 D2.1
$1N8704: length 2.1
  Top Layer w0.254: R22.1 92.78,75.21 LED2.1
$1N11163: length 5.1
  Top Layer w0.254: U30.3 45.34,29.77 45.47,29.9 45.47,30.15 45.65,30.33 48.84,30.33 R28.2
$1N11164: length 2.3
  Top Layer w0.254: R24.1 C34.2
$1N11165: length 3.4
  Top Layer w0.254: C32.1 42.54,25.47 42.54,26.97 42.72,27.15 44.1,27.15 U30.1
$1N11166: length 29.5
  Top Layer w0.762: C32.2 40.4,26.96 40.13,27.23 U30.8
  Top Layer w1.27: L3.1 27.77,24.62 D3.1 28.07,21.76 28.83,21.01 39.37,21.01 40.4,22.04 C32.2
$1N11168: length 5.4
  Top Layer w0.254: R26.1 R27.2 36.43,31.18 36.7,30.91 38.51,30.91 U30.5
$1N11169: length 4.9
  Top Layer w0.254: U30.6 R24.2
$1N11170: length 5.7
  Top Layer w0.254: U30.4 45.47,31.04 45.59,31.17 45.59,33.71 45.21,34.09 R25.2
$1N13050: length 4.5
  Top Layer w0.254: R37.1 50.44,63.55 Q3.3 50.36,63.48 47.75,63.48
$1N13125: length 16.1
  Top Layer w0.254: U33.1 54.25,65.44 R39.1 R40.2 51.82,69.39 51.44,69.01 51.44,63.04 50.8,62.41 49.66,62.41 49.47,62.22 49.47,61.53
$1N13319: length 4
  Top Layer w0.254: R40.1 56.3,69.34 57.86,69.34 58.04,69.52 58.04,70.41 58.1,70.47 Q5.1
$1N13408: length 9
  Top Layer w0.254: Q5.3 61.85,69.52 62.1,69.27 R41.1
  Top Layer w1.016: U34.1 66.42,69.27 65.15,69.27 64.77,68.89 64.77,67.49 64.63,67.34 R41.1
$1N13756: length 7.1
  Top Layer w0.254: R32.1 R33.2
  Top Layer w1.016: U35.1 44.96,63.42 45.72,64.19 R32.1
$1N13895: length 34.5
  Top Layer w0.254: R41.2 62.1,63.31 R42.2
  Top Layer w0.508: R39.2 56.25,66.33 55.44,65.52 55.44,64.44 ; 55.44,64.44 55.31,64.31 U33.2 ; 55.44,64.44 55.44,58.92 56.64,57.71 65.28,57.71 66.55,58.98 U34.3 65.28,64.31 64.26,65.33 62.12,65.33 R41.2
$1N13934: length 5.4
  Top Layer w0.254: U33.4 60.02,63.36 R42.1 60.09,61.35 R35.2
$1N13952: length 2.3
  Top Layer w0.254: R34.2 R35.1
$1N14002: length 5.4
  Top Layer w0.254: R43.1 R37.2 52.58,65.19 52.58,63.68 52.89,63.36 U33.3
$1N14008: length 4.8
  Top Layer w0.254: R43.2 50.42,67.34 R33.1 D8.1

## Copper pours and planes (outline as drawn; the poured copper is in the pictures)
+5V on Top Layer: 21.2,19.1 22.35,17.95 22.35,13.64 21.72,13 7.75,13 6.16,14.59 4.19,14.59 3.37,15.42 3.37,18.15 4.32,19.1
+12V on Top Layer: 20.07,91.36 38.61,91.36 39.5,90.47 39.5,88.06 40.51,87.05 44.45,87.05 44.7,86.79 44.7,82.62 43.1,81.01 22.54,81.01 19.69,83.87 19.69,90.98
+12V on Bottom Layer: 18.98,88.04 17.8,88.04 17.53,88.32 17.53,90.47 18.54,91.49 26.92,91.49 27.18,91.24 27.18,90.22 26.92,89.97 19.43,89.97 19.3,89.84 19.3,88.36
+12V on Bottom Layer: 25.72,82.09 22.48,82.09 22.1,81.71 22.1,79.17 21.21,78.28 12.91,78.28 12.54,78.65 12.54,80.34 12.45,80.44 10.82,80.44 10.55,80.17 10.55,76.56 10.78,76.33 25.48,76.33 26.03,76.89 26.03,81.78
+12V on Bottom Layer: 19.33,85.18 19.68,84.83 19.68,84.26 19.94,84 23.88,84 24.13,83.74 24.13,83.36 23.75,82.98 19.3,82.98 18.8,83.49 18.8,84.12 18.38,84.54 17.62,84.54 17.53,84.63 17.53,85.04 17.67,85.18
+16.8V on Top Layer: 84.58,70.92 76.36,70.92 76.36,68.21 77.98,66.6 77.98,58.72 77.09,57.84 68.83,57.84 66.8,55.8 66.8,48.56 67.44,47.93 71.25,47.93 72.14,48.82 72.14,51.99 73.15,53.01 79.88,53.01 84.58,57.71
+16.8V on Top Layer: 43.18,28.96 47.52,28.96 47.7,28.78 47.7,26.77 47.88,26.59 55.12,26.59 55.5,26.21 55.5,24.44 55.25,24.18 45.59,24.18 45.34,24.44 45.34,27.74 45.09,27.99 43.18,27.99 43.05,28.12 43.05,28.84
+16.8V on Top Layer: 55.23,92.16 57.5,92.16 57.91,91.75 60.71,91.75 60.96,91.49 60.96,89.84 61.09,89.71 69.47,89.71 69.69,89.49 69.69,88.03 69.47,87.81 58.55,87.81 58.17,88.19 58.17,90.86 57.91,91.11 55.25,91.11 55.12,91.24 55.12,92.04
+16.8V on Top Layer: 69.34,89.71 83.04,89.71 84.33,88.43 84.33,85.27 83.69,84.63 71.12,84.63 69.47,86.28 69.47,87.68 69.22,87.94 69.22,89.59
+16.8V on Top Layer: 54.48,26.59 56.9,29.01 56.9,51.99 58.8,53.9 66.42,53.9 67.31,54.79 67.31,50.47 67.06,50.47 66.39,51.14 61.25,51.14 60.32,50.22 60.32,25.83 58.67,24.18 55.12,24.18 54.48,24.82
+16.8V on Top Layer: 84.33,97.59 81.03,97.59 80.65,97.21 80.65,73.08 78.87,71.3 78.87,70.03 80.26,68.63 83.82,68.63 84.58,69.39 84.58,97.33
+16.8V on Top Layer: 47.37,12.88 47.54,12.71 47.54,10.81 48.77,9.58 52.83,9.58 52.96,9.45 52.96,7.67 52.71,7.42 42.67,7.42 42.42,7.67 42.42,9.19 42.8,9.58 44.33,9.58 44.58,9.83 44.58,11.48 44.32,11.74 42.16,11.74 42.04,11.86 42.04,12.71 42.21,12.88
+16.8V on Top Layer: 66.1,67.85 65.85,67.6 65.85,65.94 66.1,65.69 68.38,65.69 70.66,67.98 82.36,67.98 83.38,68.99 83.38,70.86 82.41,71.83 71.01,71.83 67.04,67.85
+16.8V on Bottom Layer: 84.39,97.59 81.09,97.59 80.71,97.21 80.71,73.97 78.55,71.81 78.55,70.41 80.33,68.63 83.88,68.63 84.65,69.39 84.65,97.33
+16.8V on Bottom Layer: 84.58,70.98 72.77,70.98 72.77,68.44 73.41,67.81 73.41,61.33 72.64,60.57 71.75,60.57 66.8,55.61 66.8,48.63 67.44,47.99 71.25,47.99 72.14,48.88 72.14,52.06 73.15,53.07 79.88,53.07 84.58,57.77
+16.8V on Bottom Layer: 66.17,67.87 65.91,67.61 65.91,65.96 66.17,65.71 68.44,65.71 70.73,68 82.42,68 82.8,68.38 82.8,71.51 82.47,71.84 71.08,71.84 67.1,67.87
GND on Top Layer: -10.16,107.62 104.27,107.62 104.27,-7.44 -10.16,-7.44
GND on Bottom Layer: -5.33,105.46 104.78,105.46 104.78,-14.81 -5.33,-14.81
VIN on Top Layer: 22.67,64.31 30.61,64.31 32.26,62.66 32.26,55.93 37.34,50.85 44.07,50.85 46.61,53.39 49.4,53.39 51.69,51.11 51.69,46.15 50.8,45.26 24.26,45.26 21.46,48.06 21.46,63.1
VIN on Bottom Layer: 22.54,64.44 30.48,64.44 32.13,62.79 32.13,56.06 37.21,50.98 43.94,50.98 46.48,53.52 49.28,53.52 51.56,51.23 51.56,46.28 50.67,45.39 24.13,45.39 21.34,48.18 21.34,63.23
UBAT on Top Layer: 20.95,74.98 46.33,74.98 46.82,74.49 46.82,67.83 46.48,67.49 21.47,67.49 20.16,68.8 20.16,74.19
UBAT on Bottom Layer: 20.93,75.04 43.76,75.04 45.02,73.79 45.02,68.53 44.04,67.55 21.44,67.55 20.13,68.86 20.13,74.25
VS on Top Layer: 21.39,33.29 23.02,33.29 23.24,33.07 23.24,29.51 22.86,29.13 4.06,29.13 3.49,29.71 3.49,33.38 4.19,34.09 20.6,34.09
$1N13895 on Bottom Layer: 41.5,67.11 44.68,67.11 45.72,68.15 45.72,74.6 46.61,75.49 64.01,75.49 65.15,74.35 65.15,65.58 65.41,65.33 67.92,65.33 68.74,64.51 68.74,58 68.2,57.45 46.35,57.45 44.83,58.98 44.83,63.68 43.69,64.82 41.66,64.82 41.15,65.33 41.15,66.76

Small or netless copper shapes (teardrops, artwork), in the pictures only: 483 on Top Layer, 65 on Bottom Layer

## Text on the board
Top Silkscreen Layer: +5V / (VS) | VIN | GND | POW | OA2 | OA1 | OB1 | OB2 | 16.8VOUT | RX | TX | +5V | EN | STEP | DIR | MS2 | MS1 | RoboPioneers / @LC / 2025/4/3 | 底盘专用 | 风机专用 | 静音 | 运动 | 机甲杯正赛 / 步进驱动&DCDC / CAN收发&电池保护
